# Altium schematic sheet input.SchDoc
size A; SheetNumber: 1; SheetTotal: 3
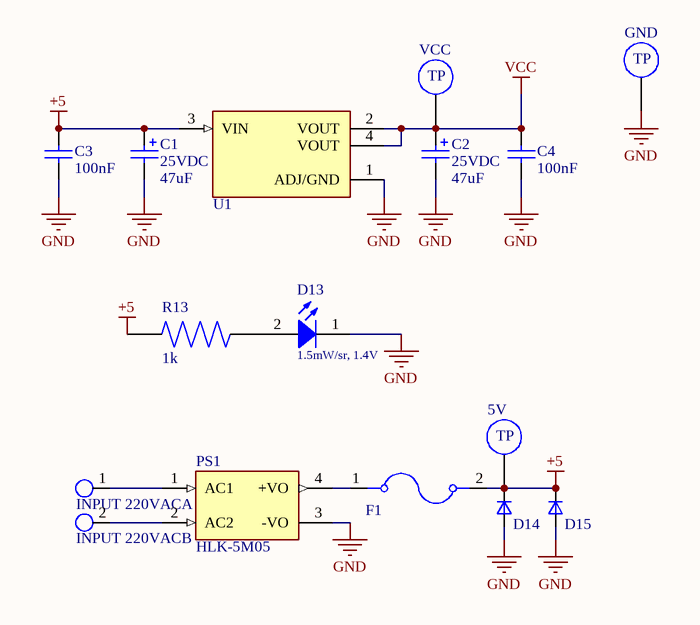
[diagram p0: input.SchDoc]

## Parts
5V  TEST POINT  [Test point]  (value not drawn)  (no BOM)
C1  Rated Voltage: 25VDC  Capacitance: 47uF  [D6.3H7.7]  (hidden comment: Electrolyt Cap)
C2  Rated Voltage: 25VDC  Capacitance: 47uF  [D6.3H7.7]  (hidden comment: Electrolyt Cap)
C3  Capacitance: 100nF  [0603_WAVE]  (hidden comment: Ceramic Cap)
C4  Capacitance: 100nF  [0603_WAVE]  (hidden comment: Ceramic Cap)
D13  1.5mW/sr, 1.4V  [0805_L2W1.3H0.8]
D14  M7 Diode  [SMA]  (value not drawn)
D15  M7 Diode  [SMA]  (value not drawn)
F1  Fuse  [FUSE]  (value not drawn)
GND  TEST POINT  [Test point]  (value not drawn)  (no BOM)
INPUT_220VAC  AK300/2  [AK300/2]  (value not drawn)  (parts A,B of 2)
PS1  HLK-5M05  [HLK-5M05]
R13  value 1k  [1206]  (hidden comment: 1206 Res)
U1  AMS1117  [SOT229P700X180-4N]  (value not drawn)
VCC  TEST POINT  [Test point]  (value not drawn)  (no BOM)

## Nets
+5: 5V.TP C1.1(P) C3.2 D14.CATHODE D15.CATHODE F1.2 R13.1 U1.3(VIN)
GND: C1.2(N) C2.2(N) C3.1 C4.1 D13.1(K) D14.ANNODE D15.ANNODE GND.TP PS1.3(-VO) U1.1(ADJ/GND)
VCC: C2.1(P) C4.2 U1.2(VOUT) U1.4(VOUT) VCC.TP
NetD13_2: D13.2(A) R13.2
NetF1_1: F1.1 PS1.4(+VO)
NetINPUT_220VAC_1: INPUT_220VAC.1(KL) PS1.1(AC1)
NetINPUT_220VAC_2: INPUT_220VAC.2(KL) PS1.2(AC2)

## Library data of the parts
C1 C2 = Electrolyt Cap: WCAP-ASLI Aluminum Electrolytic Capacitor, V-Chip, SMT, D16xH17mm; Manufacturer Part Number: 865080163018; Manufacturer: Wurth Elektronik; Technical Reference: ASEK170682M6R3DVCTHB000; Ripple Current: 1250mA; Capacitance Tolerance: +/-20%; Leakage Current: 428.4uA; Endurance: 2000h; Dissipation Factor: 24%; Packaging: Tape and Reel; Published Date: October 2020; Operating Temperature: -55 to +105degC; Mounting Technology: SMT; Height: 17mm; ComponentLink1Description: Manufacturer; ComponentLink1URL: http://www.we-online.de; ComponentLink2Description: Datasheet; ComponentLink2URL: https://www.we-online.com/catalog/datasheet/865080163018.pdf; Diameter: 16mm
C3 C4 = Ceramic Cap: WCAP-CSGP Multilayer Ceramic Chip Capacitor, General Purpose, size 1812, X7R; Manufacturer Part Number: 885012210019; Manufacturer: Wurth Elektronik; Rated Voltage: 50VDC; Isolation Resistance: >=10GOhm; Capacitance Tolerance: +/-10%; Technical Reference: X7R1812103K050DFCT10000; ComponentLink1Description: Manufacturer; ComponentLink1URL: http://www.we-online.de; ComponentLink2Description: Datasheet; ComponentLink2URL: https://www.we-online.com/catalog/datasheet/885012210019.pdf; Operating Temperature: -55 to +125degC; Packaging: Tape and Reel; Published Date: May 2020; Ceramic Type: X7R; Dissipation Factor: =<2.5%; Height: 1.25mm; Mounting Technology: SMT; Size: 1812
D13 = 0805 Led: WL-SICW SMT Chip LED Infrared Waterclear, size 0805, 1.5mW/sr, 1.4V; Manufacturer Part Number: 15408085BA400; Manufacturer: Wurth Elektronik; Chip Technology: AlGaAs; Forward Voltage max.: 2V; Centroid Wavelength typ.: 845nm; Peak Wavelength typ.: 850nm; Radiant Intensity min.: 0.6mW/sr; Viewing Angle: 140deg; Radiant Intensity typ.: 1.5mW/sr; ComponentLink1Description: Manufacturer; ComponentLink1URL: http://www.we-online.de; ComponentLink2URL: https://www.we-online.com/catalog/datasheet/15408085BA400.pdf; ComponentLink2Description: Datasheet; Emitting Color: Infrared; Forward Voltage typ.: 1.4V; Mounting Technology: SMT; Operating Temperature: -40 to +85degC; Published Date: August 2020; Packaging: Tape and Reel; Size: 0805
D14 D15 = M7 Diode: Diode Standard 400V 1A Surface Mount SMA _DO-214AC_; MF: ON Semiconductor; MP: S1G; Price: None; Value: *; Availability: Unavailable; SnapEDA_Link: https://www.snapeda.com/parts/S1G/ON%20Semiconductor/view-part/1474196/?ref=snap; Package: DO-214AC ON Semiconductor
F1 = Fuse: 4A 125V AC 125V DC Fuse Board Mount _Cartridge Style Excluded_ Holder, Surface Mount 2-SMD, Square End Block with Holder; MF: Littelfuse Inc.; MP: 0154004.DR; Digi-Key_Part_Number: F1227CT-ND; SnapEDA_Link: https://www.snapeda.com/parts/0154004.DR/Littelfuse%20Inc./view-part/1215896/?ref=snap; Value: *; Digi-Key_Purchase_URL: https://www.digikey.com/product-detail/en/littelfuse-inc/0154004.DR/F1227CT-ND/183376?utm_source=snapeda&utm_medium=aggregator&utm_campaign=symbol; Package: SMD-2 Littelfuse
INPUT_220VAC = AK300/2: MP: AK300/3; MF: Altech; Package: None; Availability: Unavailable; SnapEDA_Link: https://www.snapeda.com/parts/AK300/3/Altech/view-part/2748485/?ref=snap; Check_prices: https://www.snapeda.com/parts/AK300/3/Altech/view-part/2748485/?ref=eda; Value: *; Price: None
PS1 = HLK-5M05: AC DC 220V to 5V 5W 5Watt Isolated Switching Step-Down Power Supply Module Converter; MF: Hi-link; Availability: Unavailable; SnapEDA_Link: https://www.snapeda.com/parts/HLK-5M05/Hi-link/view-part/2758659/?ref=snap; Price: None; Package: Package Analog Devices; MP: HLK-5M05; Value: *
R13 = 1206 Res: Res 1206 10 Ohm 5% 1/8W Â±500ppm/Â°C Molded SMD SMD T/R; Resistance: 10; MP: FCR1206J10R; Power_Rating: .125 W; MF: TE Connectivity; DigiKey-Purchase-URL: https://snapeda.com/shop?store=DigiKey&id=988597; Package: 1206; EU_RoHS_Compliance: Compliant with Exemptions; Tolerance: 5%; Price: None; SnapEDA_Link: https://www.snapeda.com/parts/FCR1206J10R/TE%20Connectivity%20Passive%20Product/view-part/988597/?ref=snap; Mouser-Purchase-URL: https://snapeda.com/shop?store=Mouser&id=988597; Availability: Warning
U1 = AMS1117: UNO PLUS Arduino R3 Shield, Xbee Arduino IDE Wheeled Robotics Kit; MF: Seeed Technology; Availability: Unavailable; SnapEDA_Link: https://www.snapeda.com/parts/AMS1117/Seeed%20Technology%20Co.%2C%20Ltd/view-part/184428/?ref=snap; MP: AMS1117; Price: None; Value: *; Package: SOT-223 Seeed Technology